# EAGLE board 7219_32_16 (EAGLE 7.7.0)
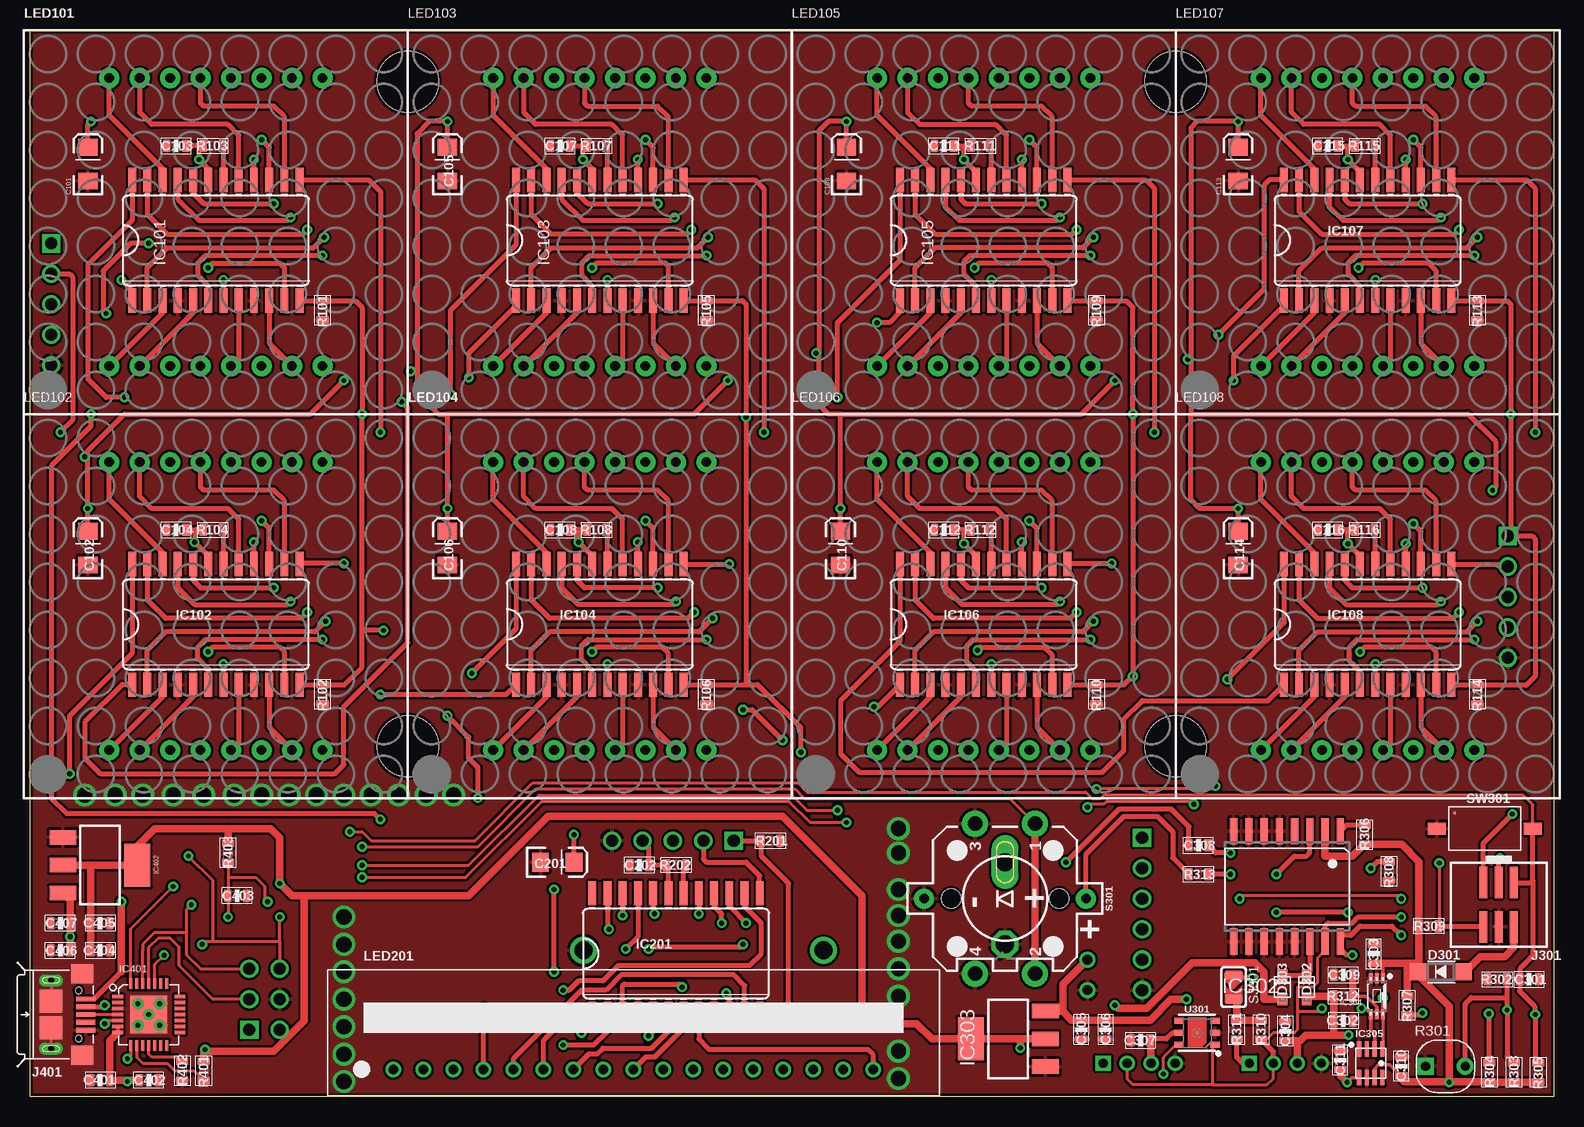
[diagram p6: board, top side]
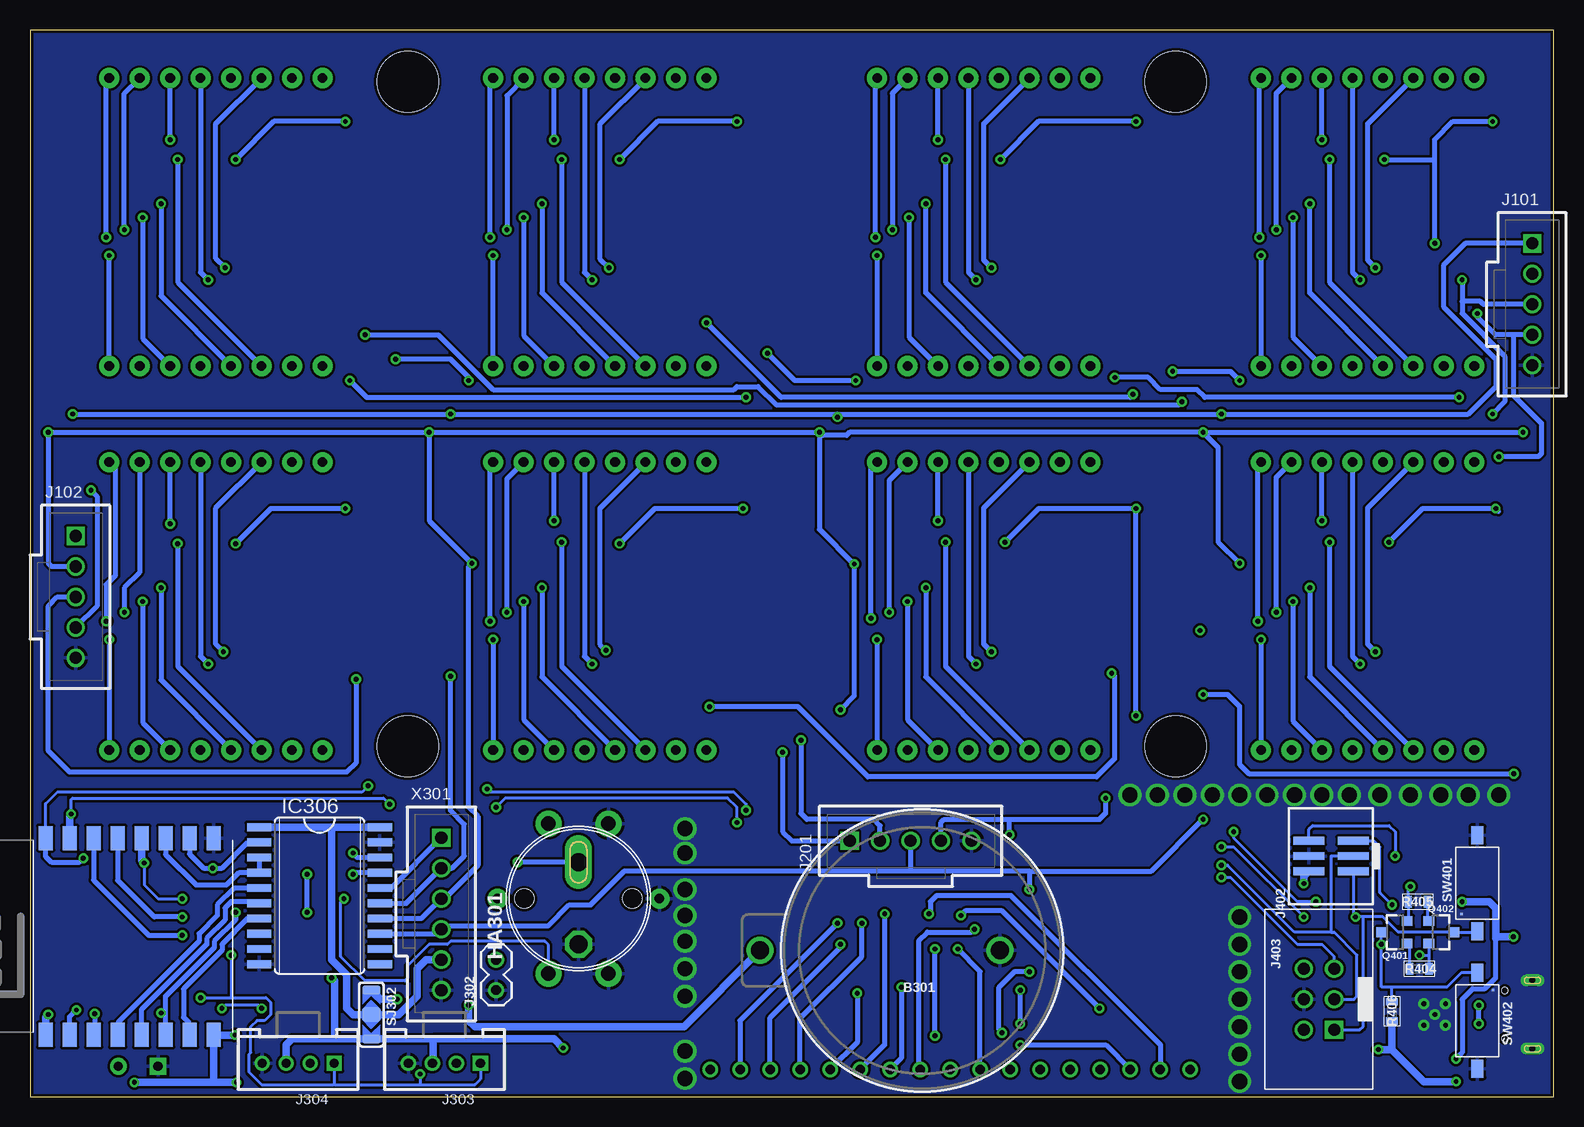
[diagram p7: board, bottom side, seen from below]

Size 127 x 88.9 mm. Coordinates in mm from the lower left corner, seen from the top.
Outline: 0,88.9 127,88.9 127,0 0,0 0,88.9
Copper layers (1*16): Top 0.035mm / dielectric 1.5mm / Bottom 0.035mm
Design rules "adafruit *": minimum track width 8mil, minimum drill 15.5mil, track to track 8mil, track to pad 8mil, pad to pad 8mil, via to via 8mil, smd to smd 8mil, copper to edge 10mil, drill to drill 8mil, minimum pad ring 10mil, minimum via ring 8mil, stop-mask expansion 2mil, vias tented up to drill 60mil, thermal gap 10mil
Holes 5.08 mm at 31.5,84.58 31.5,29.21 95.5,29.21 95.5,84.58

## Footprints (pad centres in the part's own frame; a part is rotated, then mirrored left to right if it is on the bottom)
CR2032 = drill 1.5: + 13.81,0; - -6.19,0
EIA3216 = smd 1.4 x 1.6: A 1.4,0; C -1.4,0
0603-CAP = smd 0.6 x 1: 1 -0.8,0; 2 0.8,0
SOD123 = smd 1.4 x 1.4: A 1.9,0; C -1.9,0
SOD-323F = smd 1 x 0.8: A -1,0; C 1,0
PBUZ_12X7.5 = drill 1.5 long: A 3.038,0 | drill 1.5 octagon: C -3.8,0
SO24L = smd 0.66 x 2.032: 1 -6.985,-5.029; 2 -5.715,-5.029; 3 -4.445,-5.029; 4 -3.175,-5.029; 5 -1.905,-5.029; 6 -0.635,-5.029; 7 0.635,-5.029; 8 1.905,-5.029; 9 3.175,-5.029; 10 4.445,-5.029; 11 5.715,-5.029; 12 6.985,-5.029; 13 6.985,5.029; 14 5.715,5.029; 15 4.445,5.029; 16 3.175,5.029; 17 1.905,5.029; 18 0.635,5.029; 19 -0.635,5.029; 20 -1.905,5.029; 21 -3.175,5.029; 22 -4.445,5.029; 23 -5.715,5.029; 24 -6.985,5.029
ESP12-SMD = smd 2 x 1.2: ADC -8.3,3.8; CH_PD -8.3,1.8; GND 8.1,-8.2; GPIO0 8.1,-2.2; GPIO2 8.1,-4.2; GPIO4 8.1,-0.2; GPIO5 8.1,1.8; GPIO12 -8.3,-4.2; GPIO13 -8.3,-6.2; GPIO14 -8.3,-2.2; GPIO15 8.1,-6.2; GPIO16 -8.3,-0.2; RESET -8.3,5.8; RXD0 8.1,3.8; TXD0 8.1,5.8; VCC -8.3,-8.2
SO16W = smd 0.6 x 2.2: 1 -4.445,-4.6; 2 -3.175,-4.6; 3 -1.905,-4.6; 4 -0.635,-4.6; 5 0.635,-4.6; 6 1.905,-4.6; 7 3.175,-4.6; 8 4.445,-4.6; 9 4.445,4.6; 10 3.175,4.6; 11 1.905,4.6; 12 0.635,4.6; 13 -0.635,4.6; 14 -1.905,4.6; 15 -3.175,4.6; 16 -4.445,4.6
SOT223 = smd 1.219 x 2.235: 1 -2.311,-3.099; 2 0,-3.099; 3 2.311,-3.099 | smd 3.6 x 2.2: 4 0,3.099
WSOF6L = smd 0.3 x 0.8: 1 -0.5,-1.5; 2 0,-1.5; 3 0.5,-1.5; 4 0.5,1.5; 5 0,1.5; 6 -0.5,1.5
LGA-8-2.5X2.5 = smd 0.35 x 1.3: 1 -0.975,1.2; 2 -0.325,1.2; 3 0.325,1.2; 4 0.975,1.2; 5 0.975,-1.2; 6 0.325,-1.2; 7 -0.325,-1.2; 8 -0.975,-1.2
SO20W = smd 0.66 x 2.032: 1 -5.715,-5.029; 2 -4.445,-5.029; 3 -3.175,-5.029; 4 -1.905,-5.029; 5 -0.635,-5.029; 6 0.635,-5.029; 7 1.905,-5.029; 8 3.175,-5.029; 9 4.445,-5.029; 10 5.715,-5.029; 11 5.715,5.029; 12 4.445,5.029; 13 3.175,5.029; 14 1.905,5.029; 15 0.635,5.029; 16 -0.635,5.029; 17 -1.905,5.029; 18 -3.175,5.029; 19 -4.445,5.029; 20 -5.715,5.029
QFN28G_0.5-5X5MM = smd 0.9 x 0.254: 1 -2.59,1.5; 2 -2.59,1; 3 -2.59,0.5; 4 -2.59,0; 5 -2.59,-0.5; 6 -2.59,-1; 7 -2.59,-1.5; 15 2.59,-1.5; 16 2.59,-1; 17 2.59,-0.5; 18 2.59,0; 19 2.59,0.5; 20 2.59,1; 21 2.59,1.5 | smd 0.254 x 0.9: 8 -1.5,-2.59; 9 -1,-2.59; 10 -0.5,-2.59; 11 0,-2.59; 12 0.5,-2.59; 13 1,-2.59; 14 1.5,-2.59; 22 1.5,2.59; 23 1,2.59; 24 0.5,2.59; 25 0,2.59; 26 -0.5,2.59; 27 -1,2.59; 28 -1.5,2.59 | smd 3.1 x 3.1: 29 0,0 | drill 0.4: HG1 -0.9,0.9; HG2 -0.9,-0.9; HG3 0.9,-0.9; HG4 0.9,0.9; HG5 0,0
70543-05 = drill 1.016 square: 1 -5.08,0 | drill 1.016: 2 -2.54,0; 3 0,0; 4 2.54,0; 5 5.08,0
2X03_1.27MM_SMT = smd 0.65 x 2.6: 1 -1.27,-1.85; 2 -1.27,1.85; 3 0,-1.85; 4 0,1.85; 5 1.27,-1.85; 6 1.27,1.85
1X02 = drill 0.813: 1 0,0; 2 2.54,0
HW4-2.0 = drill 0.762 pad 1.27 square: 1 -3,0 | drill 0.762 pad 1.27: 2 -1,0; 3 1,0; 4 3,0
USB-B-MICRO-SMD_MY = smd 1.6 x 0.4: D+ -4.4,0; D- -4.4,-0.65; GND -4.4,1.3; ID -4.4,0.65; VBUS -4.4,-1.3 | drill 0.5 long: SH@1 -1.5,-2.85; SH@2 -1.5,2.85 | smd 1.9 x 1.9: SH@3 -1.5,-1.1; SH@4 -1.5,1.1 | smd 1.8 x 1.6: SH@5 -4.1,-3.4; SH@6 -4.1,3.4 | hole 0.5: -3.8,-2; -3.8,2
2X03 = drill 1 square: 1 -2.54,-1.27 | drill 1: 2 -2.54,1.27; 3 0,-1.27; 4 0,1.27; 5 2.54,-1.27; 6 2.54,1.27
SEGMENT_BL-M12A881UR = drill 0.8 pad 1.676: 1 -8.89,-12; 2 -6.35,-12; 3 -3.81,-12; 4 -1.27,-12; 5 1.27,-12; 6 3.81,-12; 7 6.35,-12; 8 8.89,-12; 9 8.89,12; 10 6.35,12; 11 3.81,12; 12 1.27,12; 13 -1.27,12; 14 -3.81,12; 15 -6.35,12; 16 -8.89,12
АЛС318А = drill 0.8: 1 -20,-3.05; 2 -17.5,-3.05; 3 -15,-3.05; 4 -12.5,-3.05; 5 -10,-3.05; 6 -7.5,-3.05; 7 -5,-3.05; 8 -2.5,-3.05; 9 0,-3.05; 10 2.5,-3.05; 11 5,-3.05; 12 7.5,-3.05; 13 10,-3.05; 14 12.5,-3.05; 15 15,-3.05; 16 17.5,-3.05; 17 20,-3.05
SOT23-3 = smd 0.8 x 0.9: 1 -0.95,-1; 2 0.95,-1; 3 0,1.1
R0603 = smd 0.6 x 1: 1 -0.8,0; 2 0.8,0
SNR2-3.0 = drill 0.762 pad 1.397 square: 1 -1.651,0 | drill 0.762 pad 1.397: 2 1.651,0
TACTILE_SWITCH_LED_PTH_12MM_KIT = drill 1.2 pad 2.159: 1 -6.25,2.5; 2 6.25,2.5; 3 -6.25,-2.5; 4 6.25,-2.5 | drill 0.8 pad 1.676: A 0,6.75; C 0,-6.75 | hole 1.6: 0,4.5; 0,-4.5
MICROBUILDER_SOLDERJUMPER_ARROW_NOPASTE = smd 0.762 x 1.524: 1 -1.016,0; 2 1.016,0
MICROBUILDER_SOLDERJUMPER_ARROW_NOPASTE_3 = smd 1.27 x 1.524: 1 0,0 | smd 0.762 x 1.524: 2 2.032,0; 3 -2.032,0
MICROPUSH-BUT_TOP = smd 1.5 x 1: A -4,0; B 4,0 | smd 0.2 x 0.2: SH0 -2.54,1.31
DFN-6-3X3-SI7021 = smd 0.2 x 0.2: 7 0,0 | smd 0.8 x 0.5: DATA 1.5,-1; GND 1.5,0; NC@3 1.5,1; NC@4 -1.5,1; SCK -1.5,-1; VDD -1.5,0
70543-06 = drill 1.016 square: 1 -6.35,0 | drill 1.016: 2 -3.81,0; 3 -1.27,0; 4 1.27,0; 5 3.81,0; 6 6.35,0

## Placement (x,y rotation side)
B301  CR2032  [CR2032]  52.32,12.19 180 bottom
C101  10u  [EIA3216]  4.83,77.72 90 top
C102  10u  [EIA3216]  4.83,45.72 90 top
C103  0.1u  [0603-CAP]  12.19,79.25 180 top
C104  0.1u  [0603-CAP]  12.19,47.24 180 top
C105  10u  [EIA3216]  34.8,77.72 90 top
C106  10u  [EIA3216]  34.8,45.72 90 top
C107  0.1u  [0603-CAP]  44.2,79.25 180 top
C108  0.1u  [0603-CAP]  44.2,47.24 180 top
C109  10u  [EIA3216]  68.07,77.72 90 top
C110  10u  [EIA3216]  67.56,45.72 90 top
C111  0.1u  [0603-CAP]  76.2,79.25 180 top
C112  0.1u  [0603-CAP]  76.2,47.24 180 top
C113  10u  [EIA3216]  100.71,77.72 90 top
C114  10u  [EIA3216]  100.71,45.72 90 top
C115  0.1u  [0603-CAP]  108.2,79.25 180 top
C116  0.1u  [0603-CAP]  108.2,47.24 180 top
C201  10u  [EIA3216]  43.94,19.56 0 top
C202  0.1u  [0603-CAP]  50.8,19.3 180 top
C301  1u  [0603-CAP]  124.97,9.78 180 top
C302  22u  [0603-CAP]  109.47,6.35 0 top
C303  0.1u  [0603-CAP]  112.01,11.94 90 top
C304  0.1u  [0603-CAP]  104.65,5.46 270 top
C305  22u  [0603-CAP]  87.63,5.59 270 top
C306  0.1u  [0603-CAP]  89.66,5.59 270 top
C307  0.1u  [0603-CAP]  92.58,4.7 0 top
C308  10u  [0603-CAP]  97.41,20.95 180 top
C309  1u  [0603-CAP]  109.47,10.16 180 top
C310  0.1u  [0603-CAP]  114.3,2.54 270 top
C311  0.1u  [0603-CAP]  109.22,3.05 270 top
C401  0.1u  [0603-CAP]  5.84,1.4 0 top
C402  1u  [0603-CAP]  9.91,1.4 180 top
C403  1u  [0603-CAP]  17.27,16.76 180 top
C404  22u  [0603-CAP]  5.84,12.19 0 top
C405  0.1u  [0603-CAP]  5.84,14.48 0 top
C406  22u  [0603-CAP]  2.54,12.19 180 top
C407  0.1u  [0603-CAP]  2.54,14.48 180 top
D301  IN5819  [SOD123]  117.6,10.41 0 top
D302  1N4148  [SOD-323F]  106.43,9.14 90 top
D303  1N4148  [SOD-323F]  104.39,9.14 90 top
HA301  BUZZER  [PBUZ_12X7.5]  81.28,16.51 90 bottom
IC101  MAX7219  [SO24L]  15.49,71.37 0 top
IC102  MAX7219  [SO24L]  15.49,39.37 0 top
IC103  MAX7219  [SO24L]  47.5,71.37 0 top
IC104  MAX7219  [SO24L]  47.5,39.37 0 top
IC105  MAX7219  [SO24L]  79.5,71.37 0 top
IC106  MAX7219  [SO24L]  79.5,39.37 0 top
IC107  MAX7219  [SO24L]  111.51,71.37 0 top
IC108  MAX7219  [SO24L]  111.51,39.37 0 top
IC201  MAX7219  [SO24L]  53.85,11.94 0 top
IC301  ESP12F  [ESP12-SMD]  119.89,13.46 90 bottom
IC302  DS3231W  [SO16W]  104.78,17.53 180 top
IC303  LD1117  [SOT223]  81.53,4.83 90 top
IC304  BH1750  [WSOF6L]  112.27,8.38 180 top
IC305  BME280  [LGA-8-2.5X2.5]  111.76,2.79 0 top
IC306  74AC245DW  [SO20W]  102.87,16.76 270 bottom
IC401  CP2102  [QFN28G_0.5-5X5MM]  9.91,6.86 0 top
IC402  LM1117_3V3  [SOT223]  5.84,19.3 270 top
J101  IN  [70543-05]  1.78,66.04 270 bottom
J102  OUT  [70543-05]  123.19,41.66 270 bottom
J201  IN  [70543-05]  53.59,21.34 0 bottom
J301  COM  [2X03_1.27MM_SMT]  122.43,16 180 top
J302  Vin  [1X02]  88.14,8.89 90 bottom
J303  4P-2.0  [HW4-2.0]  92.46,2.79 180 bottom
J304  4P-2.0  [HW4-2.0]  104.65,2.79 180 bottom
J401  usb  [USB-B-MICRO-SMD_MY]  0.25,6.86 180 top
J402  COM1  [2X03_1.27MM_SMT]  18.54,20.07 90 bottom
J403  COM2  [2X03]  19.56,8.13 90 bottom
LED101  1088AS  [SEGMENT_BL-M12A881UR]  15.49,72.9 0 top
LED102  1088AS  [SEGMENT_BL-M12A881UR]  15.49,40.89 0 top
LED103  1088AS  [SEGMENT_BL-M12A881UR]  47.5,72.9 0 top
LED104  1088AS  [SEGMENT_BL-M12A881UR]  47.5,40.89 0 top
LED105  1088AS  [SEGMENT_BL-M12A881UR]  79.5,72.9 0 top
LED106  1088AS  [SEGMENT_BL-M12A881UR]  79.5,40.89 0 top
LED107  1088AS  [SEGMENT_BL-M12A881UR]  111.51,72.9 0 top
LED108  1088AS  [SEGMENT_BL-M12A881UR]  111.51,40.89 0 top
LED201  ALS318A  [АЛС318А]  50.29,5.33 0 top
Q401  7002  [SOT23-3]  13.21,13.72 90 bottom
Q402  7002  [SOT23-3]  9.4,13.72 270 bottom
R101  10k  [R0603]  24.38,65.53 90 top
R102  10k  [R0603]  24.38,33.53 90 top
R103  27k  [R0603]  15.24,79.25 0 top
R104  27k  [R0603]  15.24,47.24 0 top
R105  10k  [R0603]  56.39,65.53 90 top
R106  10k  [R0603]  56.39,33.53 90 top
R107  27k  [R0603]  47.24,79.25 0 top
R108  27k  [R0603]  47.24,47.24 0 top
R109  10k  [R0603]  88.9,65.53 90 top
R110  10k  [R0603]  88.9,33.53 90 top
R111  27k  [R0603]  79.25,79.25 0 top
R112  27k  [R0603]  79.25,47.24 0 top
R113  10k  [R0603]  120.65,65.53 90 top
R114  10k  [R0603]  120.65,33.53 90 top
R115  27k  [R0603]  111.25,79.25 0 top
R116  27k  [R0603]  111.25,47.24 0 top
R201  10k  [R0603]  61.72,21.34 180 top
R202  27k  [R0603]  53.85,19.3 0 top
R301  10K  [SNR2-3.0]  117.98,2.54 0 top
R302  100k  [R0603]  122.3,9.78 0 top
R303  220k  [R0603]  123.7,2.03 270 top
R304  10k  [R0603]  121.67,2.03 270 top
R305  10k  [R0603]  125.73,2.03 90 top
R306  4.7k  [R0603]  111.25,21.84 270 top
R307  4.7k  [R0603]  114.81,7.62 90 top
R308  10k  [R0603]  113.28,18.8 90 top
R309  10k  [R0603]  116.59,14.22 180 top
R310  10k  [R0603]  102.62,5.59 270 top
R311  10k  [R0603]  100.58,5.59 270 top
R312  1k  [R0603]  109.47,8.38 0 top
R313  2k  [R0603]  97.41,18.54 180 top
R401  4.7k  [R0603]  14.48,2.16 90 top
R402  4.7k  [R0603]  12.7,2.16 270 top
R403  10k  [R0603]  16.51,20.32 270 top
R404  2k  [R0603]  11.18,10.67 180 bottom
R405  2k  [R0603]  11.3,16.26 0 bottom
R406  10k  [R0603]  13.46,7.11 270 bottom
S301  SW1  [TACTILE_SWITCH_LED_PTH_12MM_KIT]  81.28,16.51 270 top
SJ301  i2c_pullup  [MICROBUILDER_SOLDERJUMPER_ARROW_NOPASTE]  100.33,9.14 270 top
SJ302  [MICROBUILDER_SOLDERJUMPER_ARROW_NOPASTE_3]  98.55,6.86 270 bottom
SW301  RST  [MICROPUSH-BUT_TOP]  121.28,22.35 0 top
SW401  RST  [MICROPUSH-BUT_TOP]  6.35,17.78 90 bottom
SW402  PRG  [MICROPUSH-BUT_TOP]  6.35,6.35 270 bottom
U301  SI7021  [DFN-6-3X3-SI7021]  97.28,5.33 0 top
X301  DSP  [70543-06]  92.71,15.24 270 bottom

## Tracks (layer width: path | path; a pad name or v marks a point on that pad's centre or on a via)
1A
  Top 0.406: IC101.14 21.21,81.66 20.32,82.55 14.48,82.55 14.22,82.8 LED101.13
1B  (via drill 0.41)
  Top 0.406: IC101.16 v18.67,78.11
  Bottom 0.406: v18.67,78.11 18.67,67.88 LED101.3
1C  (via drill 0.41)
  Top 0.406: IC101.20 13.59,75.31 14.48,74.42 v20.32,74.42
  Bottom 0.406: LED101.4 20.32,66.99 v20.32,74.42
1D  (via drill 0.41)
  Top 0.406: v23.11,72.26 22.73,71.88 11.43,71.88 9.78,73.53 IC101.23
  Bottom 0.406: 21.84,84.84 LED101.10 23.11,83.63 v23.11,72.26
1D0  (via drill 0.41)
  Top 0.406: IC101.2 9.78,69.09 11.43,70.74 23.62,70.74 v24.51,71.63
  Bottom 0.406: v24.51,71.63 24.51,84.77 LED101.9
1D1  (via drill 0.41)
  Top 0.406: IC101.11 21.21,69.09 20.83,69.47 15.24,69.47 v14.86,69.09
  Bottom 0.406: v14.86,69.09 15.49,69.72 15.49,81.09 LED101.14
1D2  (via drill 0.41)
  Top 0.406: v24.38,70.1 14.6,70.1 13.97,69.47 13.97,68.45 14.86,67.56 IC101.6
  Bottom 0.406: v24.38,70.1 LED101.8
1D3  (via drill 0.41)
  Top 0.406: IC101.7 v16.13,68.07
  Bottom 0.406: LED101.12 16.76,68.71 v16.13,68.07
1D4
  Top 0.406: IC101.3 11.05,65.34 LED101.1
1D5
  Top 0.406: IC101.10 19.94,62.8 LED101.7
1D6
  Top 0.406: IC101.5 13.59,65.34 LED101.2
1D7
  Top 0.406: IC101.8 17.4,61.53 LED101.5
1DP
  Top 0.406: IC101.22 11.05,77.34 6.6,81.79 LED101.16
1E  (via drill 0.41)
  Top 0.406: IC101.21 12.32,74.8 14.1,73.03 21.46,73.03 v21.72,73.28
  Bottom 0.406: v21.72,73.28 21.72,63.31 LED101.6
1F  (via drill 0.41)
  Top 0.406: IC101.15 19.94,79.12 v19.3,79.76
  Bottom 0.406: v19.3,79.76 LED101.11
1G
  Top 0.406: IC101.17 17.4,80.14 16.51,81.03 10.16,81.03 9.14,82.04 LED101.15
2A
  Top 0.406: LED103.13 46.23,82.8 46.48,82.55 52.32,82.55 53.21,81.66 IC103.14
2B  (via drill 0.41)
  Top 0.406: IC103.16 v50.67,78.11
  Bottom 0.406: v50.67,78.11 50.67,67.88 LED103.3
2C  (via drill 0.41)
  Top 0.406: IC103.20 45.59,75.31 46.48,74.42 v52.32,74.42
  Bottom 0.406: LED103.4 52.32,66.99 v52.32,74.42
2D  (via drill 0.41)
  Top 0.406: v55.12,72.26 54.74,71.88 43.43,71.88 41.78,73.53 IC103.23
  Bottom 0.406: v55.12,72.26 55.12,83.63 LED103.10
2D0  (via drill 0.41)
  Top 0.406: IC103.2 41.78,69.09 43.43,70.74 55.63,70.74 v56.52,71.63
  Bottom 0.406: v56.52,71.63 56.52,84.77 LED103.9
2D1  (via drill 0.41)
  Top 0.406: IC103.11 53.21,69.22 52.96,69.47 47.24,69.47 v46.86,69.09
  Bottom 0.406: v46.86,69.09 47.5,69.72 47.5,81.09 LED103.14
2D2  (via drill 0.41)
  Top 0.406: v56.39,70.1 46.61,70.1 45.97,69.47 45.97,68.45 46.86,67.56 IC103.6
  Bottom 0.406: v56.39,70.1 LED103.8
2D3  (via drill 0.41)
  Top 0.406: IC103.7 v48.13,68.07
  Bottom 0.406: LED103.12 48.77,68.71 v48.13,68.07
2D4
  Top 0.406: IC103.3 43.05,65.34 LED103.1
2D5
  Top 0.406: IC103.10 51.94,62.8 LED103.7
2D6
  Top 0.406: IC103.5 45.59,65.34 LED103.2
2D7
  Top 0.406: IC103.8 49.4,61.53 LED103.5
2DP
  Top 0.406: 43.05,76.33 IC103.22 43.05,77.34 38.61,81.79 LED103.16
2E  (via drill 0.41)
  Top 0.406: v53.72,73.28 53.47,73.03 46.1,73.03 44.32,74.8 IC103.21
  Bottom 0.406: v53.72,73.28 53.72,63.31 LED103.6
2F  (via drill 0.41)
  Top 0.406: IC103.15 51.94,79.12 v51.31,79.76
  Bottom 0.406: v51.31,79.76 LED103.11
2G
  Top 0.406: IC103.17 49.4,80.14 48.51,81.03 42.16,81.03 41.15,82.04 LED103.15
3A
  Top 0.406: IC105.14 85.22,81.66 84.33,82.55 78.49,82.55 78.23,82.8 LED105.13
3B  (via drill 0.41)
  Top 0.406: IC105.16 v82.68,78.11
  Bottom 0.406: v82.68,78.11 82.68,67.88 LED105.3
3C  (via drill 0.41)
  Top 0.406: IC105.20 77.6,74.8 77.98,74.42 v84.33,74.42
  Bottom 0.406: v84.33,74.42 84.33,66.99 LED105.4
3D  (via drill 0.41)
  Top 0.406: IC105.23 73.79,73.53 75.44,71.88 86.87,71.88 v87.25,72.26
  Bottom 0.406: LED105.10 85.85,84.84 87.25,83.44 v87.25,72.26
3D0  (via drill 0.41)
  Top 0.406: IC105.2 73.79,69.09 75.44,70.74 87.76,70.74 v88.65,71.63
  Bottom 0.406: v88.65,71.63 88.65,84.64 LED105.9
3D1  (via drill 0.41)
  Top 0.406: v78.74,69.09 79.12,69.47 84.84,69.47 85.22,69.09 IC105.11
  Bottom 0.406: LED105.14 75.69,84.84 79.5,81.03 79.5,69.85 v78.74,69.09
3D2  (via drill 0.41)
  Top 0.406: IC105.6 78.87,67.56 77.83,68.6 77.83,69.57 78.37,70.1 v88.39,70.1
  Bottom 0.406: LED105.8 v88.39,70.1
3D3  (via drill 0.41)
  Top 0.406: IC105.7 v80.14,68.07
  Bottom 0.406: LED105.12 80.77,68.71 v80.14,68.07
3D4
  Top 0.406: IC105.3 75.06,65.34 LED105.1
3D5
  Top 0.406: IC105.10 83.95,62.8 LED105.7
3D6
  Top 0.406: IC105.5 77.6,65.34 LED105.2
3D7
  Top 0.406: IC105.8 81.41,61.53 LED105.5
3DP
  Top 0.406: IC105.22 75.06,77.34 70.61,81.79 LED105.16
3E  (via drill 0.41)
  Top 0.406: IC105.21 76.33,74.17 77.47,73.03 85.6,73.03 v85.85,73.28
  Bottom 0.406: v85.85,73.28 85.85,63.44 LED105.6
3F  (via drill 0.41)
  Top 0.406: IC105.15 83.95,79.12 v83.31,79.76
  Bottom 0.406: v83.31,79.76 LED105.11
3G
  Top 0.406: IC105.17 81.41,80.14 80.52,81.03 74.17,81.03 73.15,82.04 LED105.15
4A
  Top 0.406: LED107.13 110.24,82.8 110.49,82.55 116.33,82.55 117.22,81.66 IC107.14
4B  (via drill 0.41)
  Top 0.406: IC107.16 v114.68,78.11
  Bottom 0.406: v114.68,78.11 114.68,67.88 LED107.3
4C  (via drill 0.41)
  Top 0.406: IC107.20 109.6,74.8 109.98,74.42 v116.08,74.42
  Bottom 0.406: v116.08,74.42 116.08,66.74 LED107.4
4D  (via drill 0.41)
  Top 0.406: v119.13,72.26 118.75,71.88 107.7,71.88 105.79,73.79 IC107.23
  Bottom 0.406: v119.13,72.26 119.13,83.63 LED107.10
4D0  (via drill 0.41)
  Top 0.406: v120.65,71.63 119.76,70.74 107.7,70.74 105.79,68.83 IC107.2
  Bottom 0.406: v120.65,71.63 120.65,84.64 LED107.9
4D1  (via drill 0.41)
  Top 0.406: v110.74,69.09 111.12,69.47 116.59,69.47 117.22,68.83 IC107.11
  Bottom 0.406: v110.74,69.09 111.51,69.85 111.51,81.09 LED107.14
4D2  (via drill 0.41)
  Top 0.406: v120.4,70.1 110.49,70.1 109.85,69.47 109.85,68.58 110.87,67.56 IC107.6
  Bottom 0.406: LED107.8 v120.4,70.1
4D3  (via drill 0.41)
  Top 0.406: IC107.7 v112.14,68.07
  Bottom 0.406: LED107.12 112.78,68.71 v112.14,68.07
4D4
  Top 0.406: IC107.3 107.06,65.34 LED107.1
4D5
  Top 0.406: IC107.10 115.95,62.8 LED107.7
4D6
  Top 0.406: IC107.5 109.6,65.34 LED107.2
4D7
  Top 0.406: IC107.8 113.41,61.53 LED107.5
4DP
  Top 0.406: IC107.22 107.06,77.34 102.62,81.79 LED107.16
4E  (via drill 0.41)
  Top 0.406: IC107.21 108.33,74.17 109.47,73.03 117.35,73.03 v117.6,73.28
  Bottom 0.406: v117.6,73.28 117.6,63.18 LED107.6
4F  (via drill 0.41)
  Top 0.406: IC107.15 115.95,79.12 v115.32,79.76
  Bottom 0.406: v115.32,79.76 LED107.11
4G
  Top 0.406: IC107.17 113.41,80.14 112.52,81.03 106.17,81.03 105.16,82.04 LED107.15
5A
  Top 0.406: IC102.14 21.21,49.66 20.32,50.55 14.48,50.55 14.22,50.8 LED102.13
5B  (via drill 0.41)
  Top 0.406: IC102.16 v18.67,46.23
  Bottom 0.406: v18.67,46.23 18.67,35.88 LED102.3
5C  (via drill 0.41)
  Top 0.406: IC102.20 13.59,43.05 14.22,42.42 v20.32,42.42
  Bottom 0.406: v20.32,42.42 20.32,34.99 LED102.4
5D  (via drill 0.41)
  Top 0.406: IC102.23 9.78,41.4 11.3,39.88 22.61,39.88 v23.11,40.39
  Bottom 0.406: v23.11,40.39 23.11,51.62 LED102.10
5D0  (via drill 0.41)
  Top 0.406: IC102.2 9.78,37.21 11.3,38.73 23.75,38.73 v24.64,39.62
  Bottom 0.406: v24.64,39.62 24.64,52.64 LED102.9
5D1  (via drill 0.41)
  Top 0.406: IC102.11 21.21,37.08 20.83,37.47 15.24,37.47 v14.86,37.08
  Bottom 0.406: v14.86,37.08 15.49,37.72 15.49,49.08 LED102.14
5D2  (via drill 0.41)
  Top 0.406: IC102.6 14.86,35.69 13.97,36.58 13.97,37.47 14.6,38.1 v24.38,38.1
  Bottom 0.406: v24.38,38.1 LED102.8
5D3  (via drill 0.41)
  Top 0.406: IC102.7 v16.13,36.07
  Bottom 0.406: LED102.12 16.76,36.7 v16.13,36.07
5D4
  Top 0.406: IC102.3 11.05,33.34 LED102.1
5D5
  Top 0.406: IC102.10 19.94,30.8 LED102.7
5D6
  Top 0.406: IC102.5 13.59,33.34 LED102.2
5D7
  Top 0.406: IC102.8 17.4,29.53 LED102.5
5DP
  Top 0.406: IC102.22 11.05,45.34 6.6,49.78 LED102.16
5E  (via drill 0.41)
  Top 0.406: IC102.21 12.32,42.42 13.72,41.02 21.46,41.02 v21.72,41.27
  Bottom 0.406: v21.72,41.27 21.72,31.31 LED102.6
5F  (via drill 0.41)
  Top 0.406: IC102.15 19.94,47.37 v19.3,48.01
  Bottom 0.406: v19.3,48.01 LED102.11
5G
  Top 0.406: IC102.17 17.4,48.13 16.51,49.02 10.16,49.02 9.14,50.04 LED102.15
6A
  Top 0.406: IC104.14 53.21,49.66 52.32,50.55 46.48,50.55 46.23,50.8 LED104.13
6B  (via drill 0.41)
  Top 0.406: IC104.16 v50.67,46.23
  Bottom 0.406: v50.67,46.23 50.67,35.88 LED104.3
6C  (via drill 0.41)
  Top 0.406: IC104.20 45.59,43.05 46.23,42.42 v52.32,42.42
  Bottom 0.406: v52.32,42.42 52.32,34.99 LED104.4
6D  (via drill 0.41)
  Top 0.406: IC104.23 41.78,41.4 43.31,39.88 54.86,39.88 v55.37,40.39
  Bottom 0.406: v55.37,40.39 55.37,51.37 LED104.10
6D0  (via drill 0.41)
  Top 0.406: IC104.2 41.78,37.21 43.31,38.73 55.75,38.73 v56.9,39.88
  Bottom 0.406: v56.9,39.88 56.9,52.39 LED104.9
6D1  (via drill 0.41)
  Top 0.406: IC104.11 53.21,36.96 52.7,37.47 47.24,37.47 v46.86,37.08
  Bottom 0.406: v46.86,37.08 47.5,37.72 47.5,49.08 LED104.14
6D2  (via drill 0.41)
  Top 0.406: IC104.6 46.86,35.56 45.97,36.45 45.97,37.59 46.48,38.1 v56.39,38.1
  Bottom 0.406: v56.39,38.1 LED104.8
6D3  (via drill 0.41)
  Top 0.406: IC104.7 v48.13,36.07
  Bottom 0.406: LED104.12 48.77,36.7 v48.13,36.07
6D4
  Top 0.406: IC104.3 43.05,33.34 LED104.1
6D5
  Top 0.406: IC104.10 51.94,30.8 LED104.7
6D6
  Top 0.406: IC104.5 45.59,33.34 LED104.2
6D7
  Top 0.406: IC104.8 49.4,29.53 LED104.5
6DP
  Top 0.406: IC104.22 43.05,45.34 38.61,49.78 LED104.16
6E  (via drill 0.41)
  Top 0.406: IC104.21 44.32,42.42 45.72,41.02 53.59,41.02 v53.85,41.27
  Bottom 0.406: v53.85,41.27 53.85,31.43 LED104.6
6F  (via drill 0.41)
  Top 0.406: IC104.15 51.94,47.37 v51.31,48.01
  Bottom 0.406: v51.31,48.01 LED104.11
6G
  Top 0.406: IC104.17 49.4,48.13 48.51,49.02 42.16,49.02 41.15,50.04 LED104.15
7A
  Top 0.406: IC106.14 85.22,49.66 84.33,50.55 78.49,50.55 78.23,50.8 LED106.13
7B  (via drill 0.41)
  Top 0.406: IC106.16 v82.68,46.23
  Bottom 0.406: v82.68,46.23 82.68,35.88 LED106.3
7C  (via drill 0.41)
  Top 0.406: IC106.20 77.6,43.05 78.23,42.42 v84.33,42.42
  Bottom 0.406: v84.33,42.42 84.33,34.99 LED106.4
7D  (via drill 0.41)
  Top 0.406: IC106.23 73.79,41.4 75.31,39.88 86.74,39.88 v87.25,40.39
  Bottom 0.406: v87.25,40.39 87.25,51.5 LED106.10
7D0  (via drill 0.41)
  Top 0.406: IC106.2 73.79,37.21 75.31,38.73 87.76,38.73 v88.65,39.62
  Bottom 0.406: v88.65,39.62 88.65,52.64 LED106.9
7D1  (via drill 0.41)
  Top 0.406: v78.99,37.21 79.25,37.47 84.58,37.47 85.22,36.83 IC106.11
  Bottom 0.406: LED106.14 75.69,52.83 79.5,49.02 79.5,37.72 v78.99,37.21
7D2  (via drill 0.41)
  Top 0.406: IC106.6 78.87,35.43 78.11,36.2 78.11,37.59 78.61,38.1 v88.39,38.1
  Bottom 0.406: v88.39,38.1 LED106.8
7D3  (via drill 0.41)
  Top 0.406: IC106.7 v80.14,36.07
  Bottom 0.406: LED106.12 80.77,36.7 v80.14,36.07
7D4
  Top 0.406: IC106.3 75.06,33.34 LED106.1
7D5
  Top 0.406: IC106.10 83.95,30.8 LED106.7
7D6
  Top 0.406: IC106.5 77.6,33.34 LED106.2
7D7
  Top 0.406: IC106.8 81.41,29.53 LED106.5
7DP
  Top 0.406: IC106.22 75.06,45.34 70.61,49.78 LED106.16
7E  (via drill 0.41)
  Top 0.406: IC106.21 76.33,42.42 77.72,41.02 85.6,41.02 v85.85,41.27
  Bottom 0.406: v85.85,41.27 85.85,31.43 LED106.6
7F  (via drill 0.41)
  Top 0.406: IC106.15 83.95,47.37 v83.31,48.01
  Bottom 0.406: v83.31,48.01 LED106.11
7G
  Top 0.406: IC106.17 81.41,48.13 80.52,49.02 74.17,49.02 73.15,50.04 LED106.15
8A
  Top 0.406: IC108.14 117.22,49.66 116.33,50.55 110.49,50.55 110.24,50.8 LED108.13
8B  (via drill 0.41)
  Top 0.406: IC108.16 v114.68,46.1
  Bottom 0.406: v114.68,46.1 114.68,35.88 LED108.3
8C  (via drill 0.41)
  Top 0.406: IC108.20 109.6,43.05 110.24,42.42 v116.08,42.42
  Bottom 0.406: v116.08,42.42 116.08,34.74 LED108.4
8D  (via drill 0.41)
  Top 0.406: IC108.23 105.79,41.4 107.31,39.88 118.62,39.88 v119.13,40.39
  Bottom 0.406: LED108.10 117.86,43.69 119.13,42.42 v119.13,40.39
8D0  (via drill 0.41)
  Top 0.406: IC108.2 105.79,37.21 107.31,38.73 119.76,38.73 v120.65,39.62
  Bottom 0.406: LED108.9 120.4,52.83 119.89,52.32 119.89,43.43 120.65,42.67 v120.65,39.62
8D1  (via drill 0.41)
  Top 0.406: IC108.11 117.22,37.08 116.84,37.47 111.25,37.47 v110.87,37.08
  Bottom 0.406: v110.87,37.08 111.51,37.72 111.51,49.08 LED108.14
8D2  (via drill 0.41)
  Top 0.406: IC108.6 110.87,35.43 109.98,36.32 109.98,37.47 110.62,38.1 v120.4,38.1
  Bottom 0.406: v120.4,38.1 LED108.8
8D3  (via drill 0.41)
  Top 0.406: IC108.7 v112.14,36.07
  Bottom 0.406: LED108.12 112.78,36.7 v112.14,36.07
8D4
  Top 0.406: IC108.3 107.06,33.34 LED108.1
8D5
  Top 0.406: IC108.10 115.95,30.8 LED108.7
8D6
  Top 0.406: IC108.5 109.6,33.34 LED108.2
8D7
  Top 0.406: IC108.8 113.41,29.53 LED108.5
8DP
  Top 0.406: IC108.22 107.06,45.34 102.62,49.78 LED108.16
8E  (via drill 0.41)
  Top 0.406: IC108.21 108.33,42.42 109.73,41.02 117.35,41.02 v117.6,41.27
  Bottom 0.406: v117.6,41.27 117.6,31.18 LED108.6
8F  (via drill 0.41)
  Top 0.406: IC108.15 115.95,47.12 v115.32,47.75
  Bottom 0.406: v115.32,47.75 LED108.11
8G
  Top 0.406: IC108.17 113.41,48.13 112.52,49.02 106.17,49.02 105.16,50.04 LED108.15
9A  (via drill 0.41)
  Top 0.406: LED201.6 42.79,4.69 44.2,6.1 v44.45,6.1 | v44.45,8.89 44.96,8.89 45.72,9.65 47.75,9.65 49.02,10.92 59.94,10.92 60.96,11.94 60.96,14.48 59.56,15.88 IC201.14
  Bottom 0.406: v44.45,6.1 v44.45,8.89
9B  (via drill 0.41)
  Top 0.406: v57.66,14.48 57.66,15.24 57.02,15.88 IC201.16
  Bottom 0.406: LED201.14 62.79,6.55 57.66,11.68 v57.66,14.48
9C  (via drill 0.41)
  Top 0.406: IC201.20 51.94,15.37 v52.07,15.24
  Bottom 0.406: v52.07,15.24 51.94,15.37 51.94,16.26 51.44,16.76 45.21,16.76 32.77,4.32 32.77,2.31 LED201.2
9D  (via drill 0.41)
  Top 0.406: IC201.23 48.13,14.1 v48.26,13.97
  Bottom 0.406: v48.26,13.97 48.51,13.72 52.2,13.72 52.92,12.99 52.92,2.41 LED201.10
9D0  (via drill 0.41)
  Top 0.406: v44.45,4.32 46.99,4.32 48.13,5.46 IC201.2
  Bottom 0.406: v44.45,4.32 37.33,4.32 LED201.3
9D1
  Top 0.406: IC201.11 59.56,9.27 58.67,10.16 49.28,10.16 48.01,8.89 45.97,8.89 40.29,3.21 LED201.5
9D2
  Top 0.406: LED201.7 46.56,3.56 47.24,3.56 47.75,4.06 51.82,4.06 53.21,5.46 IC201.6
9D3
  Top 0.406: IC201.7 54.48,5.72 52.07,3.3 51.31,3.3 LED201.9
9D4  (via drill 0.41)
  Top 0.406: IC201.3 49.4,9.27 49.53,9.4 54.1,9.4 v54.36,9.14
  Bottom 0.406: v54.36,9.14 54.36,3.22 LED201.11
9D5  (via drill 0.41)
  Top 0.406: IC201.10 58.29,8.38 v58.04,8.64
  Bottom 0.406: v58.04,8.64 58.04,4.54 LED201.13
9D6  (via drill 0.41)
  Top 0.406: IC201.5 51.94,5.46 v51.56,5.08 | v59.44,12.7 59.18,12.45 51.69,12.45 v51.56,12.32
  Bottom 0.406: LED201.15 65.29,6.59 59.44,12.45 v59.44,12.7 | v51.56,5.08 v51.56,12.32
9D7
  Top 0.406: LED201.17 70.29,3.49 69.85,3.94 56.64,3.94 55.75,4.83 IC201.8
9DP  (via drill 0.41)
  Top 0.406: v37.85,7.37 37.79,7.31 LED201.4 | IC201.22 v49.4,15.11
  Bottom 0.406: v37.85,7.37 45.97,15.49 49.02,15.49 v49.4,15.11
9E  (via drill 0.41)
  Top 0.406: IC201.21 50.67,13.34 v49.66,12.32
  Bottom 0.406: LED201.8 47.79,10.45 v49.66,12.32
9F  (via drill 0.41)
  Top 0.406: IC201.15 58.29,15.88 v59.69,14.48
  Bottom 0.406: v59.69,14.48 67.82,6.35 67.82,2.31 LED201.16
9G  (via drill 0.41)
  Top 0.406: IC201.17 v55.75,15.24
  Bottom 0.406: v55.75,15.24 55.75,4.32 LED201.12
+3V3  (via drill 0.39, 0.41)
  Top 0.254: IC401.6 IC401.7
  Top 0.305: IC305.6 112.09,2.36 112.4,2.67 113.37,2.67 C310.2 | IC304.1 112.77,11.13 112.78,11.14 | IC305.8 110.18,1.59 v109.79,1.21
  Top 0.406: v101.85,9.91 100.58,9.91 SJ301.1 | U301.VDD 95.25,5.33 94.74,4.83 93.51,4.83 C307.2
  Top 0.61: 108.71,5.14 106.36,5.14 105.88,4.66 105.63,4.66 | 108.71,5.14 v109.92,5.14 | 106.36,8.08 D302.A 106.66,8.38 R312.1 C302.1 108.67,5.18 108.71,5.14 | R305.1 R303.2 R304.2 121.63,1.27 118.36,1.27 | C310.2 114.3,1.52 114.55,1.27 118.36,1.27 | 118.36,1.27 v118.3,1.21 118.3,7.56 115.7,10.16 D301.C 115.79,10.5 115.79,11.18 | 115.79,11.18 R309.2 115.79,19.6 114.34,21.04 R306.2 111.21,21.04 110.24,20.07 107.95,20.07 IC302.2 | C303.1 112.78,11.14 114.81,11.14 | 114.81,11.14 115.75,11.14 115.79,11.18 | R307.2 114.81,11.14 | C404.1 C405.1 5.04,19.27 5.08,19.3 | IC402.2 5.08,19.3 | 16.51,22.35 10.41,22.35 8.94,20.88 IC402.4 5.08,19.3 | 16.51,22.35 20.07,22.35 20.83,21.59 v20.83,17.78 21.84,16.76 22.86,16.76 | IC401.7 6.64,4.68 6.64,1.44 6.6,1.4 C401.2 8.13,1.4 | R403.1 16.51,22.35 | 8.13,1.4 C402.2 | v8.13,1.27 8.13,1.4 | 22.86,16.76 22.86,6.35 21.34,4.83 | 21.34,4.83 20.32,3.81 14.73,3.81 v14.6,3.94 14.48,3.81 R401.2 | J403.2 20.83,5.33 21.34,4.83 | 22.86,16.76 36.58,16.76 43.18,23.37 62.74,23.37 69.34,16.76 69.34,7.62 70.87,6.1 73.91,6.1 75.18,4.83 IC303.4 82.55,4.83 | 82.55,4.83 IC303.2 | v82.55,4.06 82.55,4.83 | C304.2 105.63,4.66 | J303.3 93.46,4.63 C307.2 | C311.2 109.22,1.78 v109.79,1.21 | 105.63,4.66 105.63,2.82 J304.3
  Bottom 0.61: 111.67,5.14 IC301.VCC 111.69,5.39 111.76,5.46 | 111.67,5.14 v109.92,5.14 | J304.3 105.65,4.33 105.16,4.83 101.6,4.83 | 13.5,6.31 R406.2 13.46,3.94 | v20.83,17.78 20.83,18.36 J402.2 | 13.46,3.94 10.8,1.27 v8.13,1.27 | 13.46,3.94 v14.6,3.94 | v82.55,4.06 83.31,4.83 93.38,4.83 | 101.6,4.83 SJ302.2 93.38,4.83 | v101.85,9.91 101.6,9.65 101.6,4.83 | 93.38,4.83 93.38,2.87 J303.3 | v118.3,1.21 111.76,1.21 | 111.76,1.21 v109.79,1.21 | 111.67,5.14 111.67,1.3 111.76,1.21
+5V  (via drill 0.41)
  Top 0.406: C107.1 45.97,79.25 | C105.A v34.8,81.28 33.27,81.28 32.26,80.26 32.26,60.71 | C109.A v68.07,81.28 66.55,81.28 65.79,80.52 65.79,61.98 v65.53,61.98 65.79,61.72 65.79,57.66 66.55,56.9 67.56,56.9 | C101.A 4.83,81.03 v5.08,81.28 | C103.1 R103.1 14.1,78.91 v14.1,78.11 14.86,77.34 IC101.19 | C111.1 77.72,79.25 | 77.72,79.25 R111.1 | C115.1 109.73,79.25 | 109.73,79.25 R115.1 | 45.97,79.25 46.1,79.12 v46.1,78.11 46.86,77.34 IC103.19 | 45.97,79.25 R107.1 | IC105.19 78.87,77.09 v77.85,78.11 77.85,79.12 77.72,79.25 | C113.A v100.71,81.28 97.28,81.28 96.77,80.77 96.77,61.47 | IC107.19 110.87,77.09 v109.85,78.11 109.85,79.12 109.73,79.25 | v6.35,65.28 6.1,65.53 6.1,68.83 8.38,71.12 v9.91,71.12 | v58.17,59.69 55.37,56.9 34.8,56.9 | C102.A v4.83,49.02 4.83,53.34 | v26.16,59.69 23.37,56.9 7.87,56.9 4.83,53.85 4.83,53.34 | v31.75,60.45 32,60.45 32.26,60.71 | 67.56,56.9 87.63,56.9 v90.42,59.69 | v96.52,61.47 96.77,61.47 | IC108.19 110.87,45.09 v109.85,46.1 109.85,47.12 109.73,47.24 | R116.1 109.73,47.24 | 109.73,47.24 C116.1 | C114.A v100.71,49.02 97.54,49.02 96.77,49.78 96.77,56.9 | C110.A v67.56,49.02 67.56,56.9 | R112.1 77.72,47.24 | 77.72,47.24 C112.1 | 77.72,47.24 77.85,47.12 v77.85,46.1 78.87,45.09 IC106.19 | C106.A v34.8,49.02 34.8,56.9 | 45.72,47.24 v45.72,46.23 46.86,45.09 IC104.19 | 45.72,47.24 C108.1 | R108.1 45.72,47.24 | C104.1 13.72,47.24 | 13.72,47.24 v13.72,46.23 14.86,45.09 IC102.19 | R104.1 13.72,47.24 | v4.57,53.34 4.83,53.34 | 96.77,61.47 96.77,56.9 | 96.77,56.9 119.89,56.9 122.17,54.61 122.17,50.8 v121.92,50.55 | IC201.19 53.21,19.14 R202.1 C202.1 51.6,20.79 J201.4 | 32.26,60.71 32.26,58.67 34.04,56.9 34.8,56.9
  Top 0.406: C201.A v45.34,21.84 | v34.8,31.75 36.58,29.97 36.58,28.19 37.34,27.43 v37.34,24.89
  Bottom 0.406: v68.07,81.28 74.68,81.28 v77.85,78.11 | v34.8,81.28 42.93,81.28 v46.1,78.11 | v100.71,81.28 106.68,81.28 v109.85,78.11 | v58.17,59.69 63.25,59.69 v65.53,61.98 | v96.52,61.47 91.95,61.47 90.42,59.94 v90.42,59.69 | v100.71,49.02 106.93,49.02 v109.85,46.1 | v67.56,49.02 74.93,49.02 v77.85,46.1 | v45.72,46.23 42.93,49.02 v34.8,49.02 v34.8,31.75 | v13.72,46.23 10.92,49.02 v4.83,49.02 4.57,48.77 | v4.57,53.34 1.27,53.34 1.02,53.59 1.02,56.13 3.3,58.42 3.3,63.5 | v6.35,65.28 6.35,65.02 4.83,63.5 3.3,63.5 | v121.92,50.55 121.41,50.04 121.41,40.89 J102.4 | v31.75,60.45 26.92,60.45 v26.16,59.69 | J101.4 3.3,63.5 | J201.4 51.05,22.86 50.8,23.11 45.21,23.11 | v9.91,71.12 9.91,78.23 | 9.91,78.23 9.91,79.76 8.38,81.28 v5.08,81.28 | v14.1,78.11 10.03,78.11 9.91,78.23 | v37.34,24.89 37.34,23.62 37.85,23.11 45.21,23.11 | v45.34,21.84 45.34,22.99 45.21,23.11
ADC  (via drill 0.39)
  Top 0.406: R302.2 123.1,8.26 | 123.1,8.26 123.1,7.26 v123.13,7.24 123.13,3.4 R303.1 | R301.2 119.63,7.75 120.14,8.26 123.1,8.26
  Bottom 0.406: IC301.ADC 123.69,6.68 v123.13,7.24
BUZ  (via drill 0.41)
  Top 0.406: v100.08,20.32 98.84,20.32 C308.1
  Bottom 0.406: IC306.18 99.69,19.94 v100.08,20.32
CLK  (via drill 0.41)
  Top 0.406: IC101.13 28.24,76.4 29.21,75.44 v29.21,55.37 | J101.2 3.3,68.58 3.56,68.33 3.56,56.39 v2.54,55.37 | IC105.13 93.02,76.4 93.73,75.69 v93.73,55.37 | IC107.13 124.77,76.4 125.48,75.69 v125.48,55.37 | IC103.13 60.45,76.4 61.19,75.67 v61.19,55.37 | v26.16,44.45 22.53,44.45 IC102.13 | IC108.13 122.99,44.4 J102.2 | IC106.13 86.54,44.45 v90.17,44.45 | J201.2 56.13,19.81 56.39,19.56 59.69,19.56 60.83,18.41 IC201.13 | IC104.13 v58.29,44.4 | v59.44,32.26 60.2,32.26 v62.74,29.72
  Bottom 0.406: v93.73,55.37 v125.48,55.37 125.48,44.45 125.22,44.2 J102.2 | v93.73,55.37 v61.19,55.37 | v29.21,55.37 v2.54,55.37 | v29.21,55.37 58.67,55.37 58.93,55.12 60.94,55.12 v61.19,55.37 | v29.21,55.37 27.94,54.1 27.94,46.23 v26.16,44.45 | v93.73,55.37 93.73,48.01 v90.17,44.45 90.42,44.2 90.42,24.13 89.66,23.37 89.66,19.3 92.46,16.51 X301.3 94.36,14.86 IC306.14 | v61.19,55.37 61.19,47.3 v58.29,44.4 58.29,33.4 v59.44,32.26 | v62.74,29.72 62.74,23.62 62.23,23.11 56.64,23.11 56.13,22.61 J201.2
DIN  (via drill 0.41)
  Top 0.406: IC101.1 8.51,67.18 v7.62,68.07 | v5.08,56.9 5.08,55.88 1.78,52.58 1.78,24.89 3.05,23.62 28.7,23.62 v29.21,23.11 | IC201.1 46.86,6.22 v45.97,5.33 | v43.69,10.41 v43.69,17.27
  Bottom 0.406: v7.62,68.07 7.62,66.29 | 7.62,66.29 7.62,65.28 4.06,61.72 4.06,57.91 v5.08,56.9 | v45.97,5.33 46.23,5.59 46.23,9.14 44.96,10.41 v43.69,10.41 | J101.3 5.84,66.04 6.1,66.29 7.62,66.29 | IC306.13 93.09,13.59 X301.4 92.46,14.22 83.82,14.22 82.04,16 80.26,16 77.47,18.8 53.59,18.8 | 43.69,18.8 v43.69,17.27 | 43.69,18.8 53.59,18.8 | J201.3 53.59,18.8 | 43.69,18.8 33.53,18.8 v29.21,23.11
DOUT1  (via drill 0.41)
  Top 0.406: IC103.1 40.51,65.91 36.58,61.98 v36.58,59.94 | IC101.24 8.51,73.03 4.83,69.34 4.83,59.82 6.35,58.29 v7.87,58.29
  Bottom 0.406: v36.58,59.94 33.78,59.94 32.77,58.93 29.72,58.93 29.08,58.29 v7.87,58.29
DOUT2  (via drill 0.41)
  Top 0.406: IC103.24 40.51,70.99 35.05,65.53 v35.05,58.55 | 72.52,66.42 IC105.1 72.52,65.41 71.63,64.52 v70.61,64.52
  Bottom 0.406: v35.05,58.55 35.31,58.29 64.39,58.29 v70.61,64.52
DOUT3  (via drill 0.41)
  Top 0.406: IC107.1 104.52,65.91 100.33,61.72 v100.33,59.69 | v67.31,58.29 67.31,64.52 72.52,69.72 IC105.24
  Bottom 0.406: v67.31,58.29 98.93,58.29 v100.33,59.69
DOUT4  (via drill 0.41)
  Top 0.406: IC102.1 7.67,34.34 4.57,31.24 4.57,28.19 5.84,26.92 25.4,26.92 26.16,27.69 26.16,32.51 31.5,37.85 31.5,57.4 v30.99,57.91 | IC107.24 103.33,76.4 102.87,75.95 102.87,67.31 v99.06,63.5
  Bottom 0.406: v99.06,63.5 92.96,63.5 88.39,58.93 68.33,58.93 68.07,59.18 66.29,59.18 64.77,57.66 31.24,57.66 v30.99,57.91
DOUT5  (via drill 0.41)
  Top 0.406: IC102.24 8.51,36.96 3.3,31.75 v3.3,26.92 | 40.39,33.53 40.39,34.21 IC104.1 39.7,33.53 v29.21,33.53
  Bottom 0.406: v3.3,26.92 25.4,26.92 26.16,27.69 26.16,32.51 27.18,33.53 v29.21,33.53
DOUT6  (via drill 0.41)
  Top 0.406: v70.36,32.51 70.69,32.51 IC106.1 | IC104.24 40.51,38.99 v36.83,35.31
  Bottom 0.406: v36.83,35.31 36.58,35.05 36.58,28.19 38.1,26.67 57.15,26.67 62.99,32.51 v70.36,32.51
DOUT7
  Top 0.406: IC106.24 72.52,37.97 67.56,33.02 67.56,28.57 69.09,27.05 89.41,27.05 91.19,28.83 91.19,31.5 92.71,33.02 103.2,33.02 IC108.1
DOUT8  (via drill 0.41)
  Top 0.406: IC108.24 104.52,39.5 v99.82,34.8
  Bottom 0.406: v99.82,34.8 99.82,27.81 100.58,27.05 123.7,27.05 125.48,28.83 125.48,40.89 124.71,41.66 J102.3
DTR  (via drill 0.41)
  Top 0.254: IC401.28 8.41,13.99 v11.94,17.53
  Bottom 0.254: Q401.2 12.1,14.77 R405.1 12.1,17.36 v11.94,17.53
EN  (via drill 0.41)
  Top 0.254: v26.67,22.1 27.69,22.1 28.45,21.34 37.08,21.34 41.91,26.16 64.01,26.16 64.77,25.4 88.01,25.4 88.52,24.89 89.28,24.89 89.53,25.15 124.46,25.15 125.28,24.32 SW301.B | 16.51,16.8 v16.51,14.99 | R403.2 16.51,18.29 | 16.51,18.29 16.51,16.8 | 16.51,16.8 C403.2 | 16.51,18.29 18.8,18.29 19.56,17.53 19.56,16.51 v19.81,16.26
  Top 0.406: 125.28,18.03 125.28,11.75 124.21,10.67 124.21,9.82 C301.2 124.17,8.8 125.48,7.49 v125.48,6.86 125.48,3.09 R305.2 | J301.1 125.1,17.85 125.28,18.03 | 125.28,18.03 SW301.B
  Bottom 0.254: J402.1 16.69,15.17 v16.51,14.99 15.88,14.99 | SW401.A 6.41,13.72 Q402.3 12.95,13.72 14.22,14.99 15.88,14.99 | J403.1 16.13,5.59 15.88,5.84 15.88,14.99 | v19.81,16.26 21.34,16.26 26.67,21.59 v26.67,22.1
  Bottom 0.61: IC301.RESET 125.69,6.65 v125.48,6.86
GND  (via drill 1.27)
  Top 0.254: J401.SH@2 J401.SH@4 | J401.SH@1 J401.SH@3
  other vias: 26.16,1.27 26.16,3.56 26.16,5.84 26.16,8.13 26.16,10.41 26.16,12.7 26.16,14.99 35.31,25.15 33.02,25.15 30.73,25.15 28.45,25.15 26.16,25.15 23.88,25.15 21.59,25.15 19.3,25.15 17.02,25.15 4.57,25.15 7.11,25.15 9.4,25.15 11.94,25.15 14.48,25.15 72.39,1.52 72.39,3.81 72.39,8.38 72.39,10.67 72.39,12.95 72.39,15.11 72.39,17.27 72.39,20.32 72.39,22.35
  pour Bottom: 127,0 0,0 0,88.9 127,88.9
  pour Top: 127,0 0,0 0,88.9 127,88.9
GPIO0  (via drill 0.39, 0.41)
  Top 0.254: 117.47,14.22 R309.1 117.47,14.31 v117.47,19.49 | v114.3,16.51 114.05,16.76 101.09,16.76 v100.84,16.51 | v14.35,12.7 14.6,12.95 15.24,12.95 | v27.69,20.83 37.34,20.83 42.16,25.65 63.75,25.65 64.52,24.89 81.65,24.89 S301.1 | 15.24,12.95 20.83,12.95 | 20.83,12.95 v20.83,14.99 | 20.83,12.95 J403.6 | v13.21,20.07 15.24,18.03 15.24,12.95
  Top 0.406: J301.6 117.46,14.15 R309.1
  Top 0.61: S301.1 S301.2
  Bottom 0.254: v117.47,19.49 117.47,17.65 116.33,16.51 v114.3,16.51 | Q401.3 14.35,13.67 v14.35,12.7 14.35,9.14 13.46,9.14 | 13.46,9.14 8.89,9.14 7.68,10.35 SW402.A | R406.1 13.46,9.14 | J402.6 20.39,22.28 20.07,22.61 13.72,22.61 13.21,22.1 v13.21,20.07 | v27.69,20.83 26.67,20.83 v20.83,14.99 | S301.2 83.78,12.66 84.07,12.95 91.95,12.95 92.2,12.7 93.73,12.7 95.5,10.92 95.5,9.91 95.76,9.65 99.06,9.65 101.09,11.68 101.09,16.26 v100.84,16.51
  Bottom 0.61: IC301.GPIO0 117.69,19.71 v117.47,19.49
GPIO2
  Bottom 0.406: IC306.3 IC306.4 109.6,18.67 110.62,17.65 113.16,17.65 115.69,20.18 IC301.GPIO2
GPIO12  (via drill 0.41)
  Top 0.406: v109.85,15.37 v103.89,15.37 | v103.89,18.54 105.41,20.07 106.43,20.07 106.68,20.32 IC302.3 | R307.1 115.91,6.82 v116.08,6.98
  Bottom 0.406: IC301.GPIO12 115.69,7.11 | 115.69,7.11 115.69,8.38 111.63,12.44 111.63,12.95 109.85,14.73 v109.85,15.37 | v103.89,15.37 v103.89,18.54 | v116.08,6.98 115.81,6.98 115.69,7.11
GPIO13
  Bottom 0.406: IC301.GPIO13 113.69,6.12 114.2,6.63 114.2,8.99 111,12.19 111,12.7 108.84,14.86 IC306.7
GPIO14
  Bottom 0.406: IC301.GPIO14 117.69,7.28 112.27,12.7 112.27,13.21 110.74,14.73 110.74,15.75 110.24,16.26 108.71,16.26 108.59,16.13 IC306.6
GPIO15  (via drill 0.41)
  Top 0.406: R308.2 112.31,19.6 v111.76,19.05
  Bottom 0.406: IC306.2 108.84,21.21 111,19.05 v111.76,19.05 112.52,19.05 113.69,20.22 IC301.GPIO15
GPIO16
  Bottom 0.406: IC301.GPIO16 119.63,5.22 119.63,6.22 112.9,12.95 112.9,13.59 111.38,15.11 111.38,16 109.98,17.4 IC306.5
ISET1
  Top 0.406: IC101.18 16.13,79.16 R103.2
ISET2
  Top 0.406: IC103.18 48.13,79.16 R107.2
ISET3
  Top 0.406: IC105.18 80.14,79.16 R111.2
ISET4
  Top 0.406: IC107.18 112.14,79.16 R115.2
ISET5
  Top 0.406: IC102.18 16.13,47.16 R104.2
ISET6
  Top 0.406: IC104.18 48.13,47.16 R108.2
ISET7
  Top 0.406: IC106.18 80.14,47.16 R112.2
ISET8
  Top 0.406: IC108.18 112.14,47.16 R116.2
ISET9
  Top 0.406: IC201.18 54.48,19.14 R202.2
LED  (via drill 0.41)
  Top 0.406: v100.08,18.54 R313.1
  Bottom 0.406: IC306.17 99.95,18.67 v100.08,18.54
LOAD  (via drill 0.41)
  Top 0.203: 90.49,34.35 90.49,34.33
  Top 0.406: IC101.12 24.12,66.34 24.13,66.33 R101.2 27.14,66.33 27.69,65.79 v27.69,56.9 27.69,38.86 | IC103.12 R105.2 | R105.2 59.38,66.34 59.69,66.04 v59.69,56.64 59.69,34.34 | R105.2 | IC105.12 88.89,66.34 R109.2 88.94,66.29 91.44,66.29 91.95,65.79 v91.95,56.9 91.95,35.09 | IC107.12 120.64,66.34 R113.2 123.15,66.33 123.44,66.04 v123.44,56.9 123.44,46.99 J102.1 125.22,46.74 125.48,46.48 125.48,35.05 124.71,34.29 120.69,34.29 R114.2 120.64,34.34 IC108.12 | IC106.12 88.89,34.34 R110.2 90.49,34.33 91.19,34.33 91.95,35.09 | IC102.12 24.37,34.34 R102.2 26.2,34.33 27.69,35.81 27.69,38.86 | IC104.12 56.38,34.34 R106.2 56.4,34.34 59.69,34.34 | v91.95,35.05 91.99,35.05 91.95,35.09 | IC201.12 62.53,6.91 63.25,7.62 63.25,17.78 60.96,20.07 60.96,21.3 R201.2 J201.1 | v29.46,38.86 27.69,38.86 | v64.26,28.7 64.26,30.73 60.66,34.34 59.69,34.34
  Bottom 0.406: J101.1 7.37,71.12 9.14,69.34 9.14,65.79 4.83,61.47 4.83,59.18 7.11,56.9 v27.69,56.9 59.69,56.9 | v123.44,56.9 v91.95,56.9 59.69,56.9 | v59.69,56.64 59.69,56.9 | v91.95,35.05 91.95,23.88 90.81,22.73 90.81,20.07 91.82,19.05 X301.2 95.63,16.13 IC306.15 | v64.26,28.7 64.26,22.1 63.5,21.34 J201.1
N$1
  Top 0.406: IC302.14 106.68,10.4 D302.C D303.C
N$5
  Top 0.406: S301.A 88.03,20.21 91.19,23.37 93.98,23.37 95.25,22.1 95.25,19.9 R313.2
N$9
  Top 0.254: IC401.4 J401.D+
N$10  (via drill 0.41)
  Top 0.254: IC401.5 6.48,6.36 v6.22,6.1
  Top 0.406: J401.D- 6.11,7.51 v6.22,7.62
  Bottom 0.406: v6.22,6.1 v6.22,7.62
N$16  (via drill 0.39)
  Top 0.406: R304.1 121.67,6.98 v121.6,6.92
  Bottom 0.406: v121.6,6.92 121.6,5.25 IC301.CH_PD
N$18
  Bottom 0.254: R404.2 11.98,12.53 Q401.1
N$22  (via drill 0.41)
  Top 0.406: v86.35,19.55 90.81,24 95.12,24 96.61,22.52 C308.2
  Bottom 0.406: HA301.A v86.35,19.55
N$24
  Bottom 0.254: R405.2 10.5,14.77 Q402.1
N$25
  Top 0.305: IC304.5 112.27,7.49 111.38,8.38 R312.2
  Top 0.61: C309.1 R312.2
N$32
  Top 0.406: R306.1 109.74,22.64 IC302.1
N$33
  Top 0.254: IC401.11 9.91,3.56 10.16,3.3 12.19,3.3 12.53,2.96 R402.1
N$36
  Top 0.254: IC401.9 8.91,3.29 9.4,2.79 11.43,2.79 12.06,2.16 13.68,2.16 R401.1
N$39
  Top 0.61: R310.1 R311.1 100.58,7.87 SJ301.2
N$47
  Top 0.61: D301.A 119.63,10.41 120.9,11.68 122.94,11.68 123.7,12.45 J301.2
N$52  (via drill 0.41)
  Top 0.61: D303.A 104.38,8.13 102.87,8.13 102.87,10.41 102.11,11.18 96.9,11.18 93.09,7.37 90.68,7.37 v90.42,7.62
  Bottom 0.61: B301.+ 72.48,5.84 89.92,5.84 90.42,6.35 v90.42,7.62
RTS  (via drill 0.41)
  Top 0.254: IC401.24 10.41,11.04 v11.18,11.81
  Bottom 0.254: Q402.2 10.4,11.81 | v11.18,11.81 10.4,11.81 | 10.4,11.81 10.4,10.69 R404.1
RX  (via drill 0.39, 0.41)
  Top 0.254: J403.5 14.22,10.67 13.08,11.81 13.08,13.72 | IC401.26 9.41,12.2 9.4,12.21 9.4,12.7 10.41,13.72 13.08,13.72 | v27.69,18.29 36.32,18.29 42.67,24.64 63.25,24.64 65.02,22.86 v68.07,22.86 | 13.08,13.72 13.08,15.62 v13.46,16 | v88.14,24.13 88.39,24.38 89.53,24.38 89.79,24.64 96.77,24.64 v97.03,24.38
  Top 0.406: J301.5 121.16,21.15 v123.57,23.56
  Bottom 0.254: J402.5 14.99,21.34 14.48,20.83 14.48,17.02 v13.46,16 | J403.5 18.29,11.68 19.3,12.7 21.34,12.7 26.92,18.29 v27.69,18.29 | v123.57,23.56 123.57,24.77 123.44,24.89 97.54,24.89 v97.03,24.38 | v68.07,22.86 68.07,24.13 68.83,24.89 87.38,24.89 v88.14,24.13
  Bottom 0.61: IC301.RXD0 123.69,23.44 v123.57,23.56
SCL  (via drill 0.41)
  Top 0.254: IC304.6 112.77,4.03 IC305.4 | v94.49,1.91 94.49,3.29 95.53,4.33 U301.SCK
  Top 0.305: IC304.6 112.77,8.26 v112.78,8.26
  Top 0.406: v110.24,11.81 109.73,11.81 109.22,12.32 IC302.16 109.22,13.21 109.47,13.46 110.11,13.46 110.87,14.22 113.54,14.22 v114.3,13.46 | J304.1 101.09,2.79 100.58,3.3 R311.2
  Bottom 0.254: 94.49,1.02 101.6,1.02 101.65,1.06 | 94.49,1.02 89.92,1.02 89.46,1.48 J303.1 | J304.1 101.65,1.06 | v110.24,11.81 110.24,8.26 | v112.78,8.26 110.24,8.26 | v94.49,1.91 94.49,1.02 | 101.65,1.06 101.7,1.02 107.7,1.02 108.71,2.03 108.71,3.56 108.59,3.68 108.59,5.84 108.08,6.35 107.44,6.35 106.93,6.86 106.93,7.87 107.31,8.26 110.24,8.26
  Bottom 0.406: IC301.GPIO5 121.69,18.06 117.09,13.46 v114.3,13.46
SDA  (via drill 0.41)
  Top 0.254: J303.2 91.46,1.51 91.95,1.02 98.55,1.02 | IC302.15 107.95,12.19 107.31,11.56 107.31,9.52 106.93,9.14 105.66,9.14 105.66,7.11 | 105.66,7.11 105.66,5.59 105.41,5.33 103.63,5.33 103.09,4.79 R310.2 | U301.DATA 98.54,4.33 98.55,4.32 98.55,1.02 | 98.55,1.02 103.12,1.02 103.63,1.52 103.63,2.78 J304.2 | v111,7.37 111.28,7.37 IC304.4 | 105.66,7.11 107.44,7.11 v107.7,7.37
  Top 0.305: IC304.4 111.76,6.87 111.76,5.59 112.09,5.26 IC305.3
  Top 0.406: IC302.15 107.95,14.22 108.2,14.48 110.24,14.48 110.74,14.99 v114.3,14.99 | J304.2 103.65,3.76 R310.2
  Bottom 0.254: v107.7,7.37 107.95,7.62 110.74,7.62 v111,7.37
  Bottom 0.406: v114.3,14.99 116.64,14.99 119.69,18.03 IC301.GPIO4
TX  (via drill 0.39, 0.41)
  Top 0.254: J403.3 15.24,8.13 12.45,10.92 12.45,12.45 11.68,13.21 10.67,13.21 9.91,12.45 IC401.25 | v27.69,19.3 36.58,19.3 42.42,25.15 63.5,25.15 64.77,23.88 v67.31,23.88 | v98.81,25.91 98.55,25.65 v88.9,25.65
  Top 0.406: J301.3 122.43,19.75 v122.56,19.88
  Bottom 0.254: J402.3 18.54,20.07 18.54,13.72 | J403.3 16.64,8.13 16.38,8.38 16.38,11.81 18.29,13.72 18.54,13.72 | 18.54,13.72 21.59,13.72 27.18,19.3 v27.69,19.3 | IC301.TXD0 125.69,24.43 124.71,25.4 99.31,25.4 v98.81,25.91 | v67.31,23.88 67.31,24.38 68.33,25.4 88.65,25.4 v88.9,25.65
  Bottom 0.406: IC301.TXD0 125.69,20.02 125.22,19.56 122.87,19.56 v122.56,19.88
V_OUT
  Bottom 0.61: X301.5 93.98,11.43 94.74,10.67 94.74,8.38 96.27,6.86 SJ302.1 100.08,6.86 100.58,7.37 100.58,10.16 101.85,11.43 101.85,22.48 | IC306.1 101.85,22.48 | IC306.20 101.85,22.48
VBUS  (via drill 0.41)
  Top 0.254: IC401.8 8.41,3.45 v8.13,3.18
  Top 0.406: J401.VBUS 5.36,8.16 7.62,10.41
  Top 0.61: C406.1 v3.34,13.34 C407.1 3.34,16.4 IC402.3 | 7.62,10.41 v7.62,16.26
  Bottom 0.406: v8.13,3.18 7.62,3.68 7.62,8.13 6.73,9.02 5.72,9.02 4.83,9.91 4.83,13.21
  Bottom 0.61: v7.62,16.26 5.37,16.26 4.83,15.71 4.83,13.21 4.7,13.34 v3.34,13.34
VIN  (via drill 0.41)
  Top 0.61: J302.2 86.11,9.4 86.11,7.11 | 86.11,7.11 86.83,6.39 C305.1 C306.1 93.38,6.39 95.12,8.13 v96.39,8.13 | 84.66,7.11 IC303.3 86.08,7.14 86.11,7.11
  Bottom 0.61: v96.39,8.13 97.79,8.13 SJ302.3
WR
  Bottom 0.406: IC306.16 96.9,17.4 X301.1

## Text on the board
bValues: CS | <-1 | <-2 | <-3 | <-4 | CLK | DIN | VCC | GND | CS | CLK | DOUT | 8 | <-5 | <-6 | <-7 | VCC | GND | W | L | C | + | D | GND | VCC | DOUT | CLK | CS | V | G | C | D | V | G | - | C | D | V | G